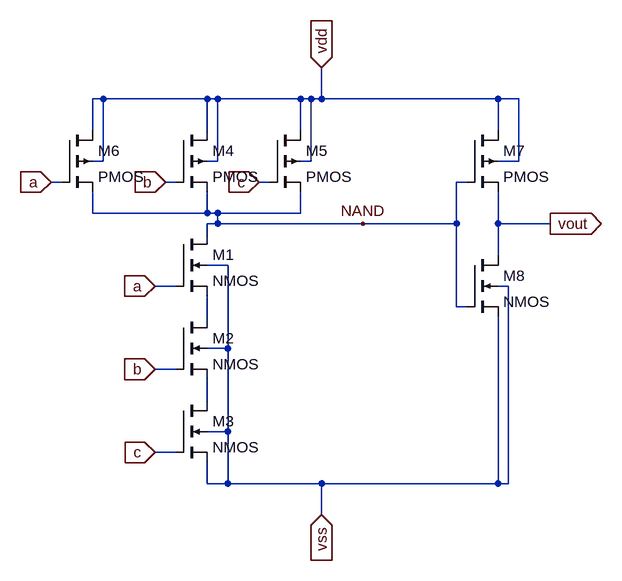
[diagram p0: schematic and_3_input.asc]
and_3_input.asc, the LTspice schematic file:
Version 4
SHEET 1 880 688
WIRE 48 -48 32 -48
WIRE 208 -48 48 -48
WIRE 224 -48 208 -48
WIRE 352 -48 224 -48
WIRE 368 -48 352 -48
WIRE 384 -48 384 -96
WIRE 384 -48 368 -48
WIRE 656 -48 384 -48
WIRE 688 -48 656 -48
WIRE 32 0 32 -48
WIRE 208 0 208 -48
WIRE 352 0 352 -48
WIRE 656 0 656 -48
WIRE 48 48 48 -48
WIRE 48 48 32 48
WIRE 224 48 224 -48
WIRE 224 48 208 48
WIRE 368 48 368 -48
WIRE 368 48 352 48
WIRE 688 48 688 -48
WIRE 688 48 656 48
WIRE -16 80 -32 80
WIRE 160 80 144 80
WIRE 304 80 288 80
WIRE 608 80 592 80
WIRE 32 128 32 96
WIRE 208 128 208 96
WIRE 208 128 32 128
WIRE 224 128 208 128
WIRE 352 128 352 96
WIRE 352 128 224 128
WIRE 224 144 224 128
WIRE 224 144 208 144
WIRE 448 144 224 144
WIRE 592 144 592 80
WIRE 592 144 448 144
WIRE 656 144 656 96
WIRE 736 144 656 144
WIRE 208 160 208 144
WIRE 656 192 656 144
WIRE 240 208 208 208
WIRE 160 240 128 240
WIRE 672 240 656 240
WIRE 592 272 592 144
WIRE 608 272 592 272
WIRE 208 288 208 256
WIRE 240 336 240 208
WIRE 240 336 208 336
WIRE 160 368 128 368
WIRE 208 416 208 384
WIRE 240 464 240 336
WIRE 240 464 208 464
WIRE 160 496 128 496
WIRE 208 544 208 512
WIRE 240 544 240 464
WIRE 240 544 208 544
WIRE 384 544 240 544
WIRE 656 544 656 288
WIRE 656 544 384 544
WIRE 672 544 672 240
WIRE 672 544 656 544
WIRE 384 592 384 544
FLAG 448 144 NAND
FLAG 384 592 vss
IOPIN 384 592 In
FLAG 128 496 c
IOPIN 128 496 In
FLAG 128 368 b
IOPIN 128 368 In
FLAG 128 240 a
IOPIN 128 240 In
FLAG -32 80 a
IOPIN -32 80 In
FLAG 144 80 b
IOPIN 144 80 In
FLAG 288 80 c
IOPIN 288 80 In
FLAG 384 -96 vdd
IOPIN 384 -96 In
FLAG 736 144 vout
IOPIN 736 144 Out
SYMBOL nmos4 160 160 R0
SYMATTR InstName M1
SYMATTR Value2 l=180n w=1080n
SYMBOL nmos4 160 288 R0
SYMATTR InstName M2
SYMATTR Value2 l=180n w=1080n
SYMBOL nmos4 160 416 R0
SYMATTR InstName M3
SYMATTR Value2 l=180n w=1080n
SYMBOL pmos4 160 0 R0
SYMATTR InstName M4
SYMATTR Value2 l=180n w=1440n
SYMBOL pmos4 304 0 R0
SYMATTR InstName M5
SYMATTR Value2 l=180n w=1440n
SYMBOL pmos4 -16 0 R0
SYMATTR InstName M6
SYMATTR Value2 l=180n w=1440n
SYMBOL pmos4 608 0 R0
SYMATTR InstName M7
SYMATTR Value2 l=180n w=1440n
SYMBOL nmos4 608 192 R0
SYMATTR InstName M8
SYMATTR Value2 l=180n w=360n

The netlist it stands for:
* and_3_input.asc
M1 NAND a N001 vss NMOS l=180n w=1080n
M2 N001 b N002 vss NMOS l=180n w=1080n
M3 N002 c vss vss NMOS l=180n w=1080n
M4 vdd b NAND vdd PMOS l=180n w=1440n
M5 vdd c NAND vdd PMOS l=180n w=1440n
M6 vdd a NAND vdd PMOS l=180n w=1440n
M7 vdd NAND vout vdd PMOS l=180n w=1440n
M8 vout NAND vss vss NMOS l=180n w=360n
.model NMOS NMOS
.model PMOS PMOS
.lib standard.mos
.backanno
.end